# EasyEDA Pro project gen_lora_i2c-revision-2--design.epro

# Schematic Schematic1

## Sheets
1 devices: Board Name: Board1; Create Date: 2026-06-19; Page Name: devices; Project Name: esp32c3_carrier-revision-1; Schematic Name: Schematic1; Update Date: 2026-06-19; Company: EasyEDA.com; Page Size: A4; Version: V1.0
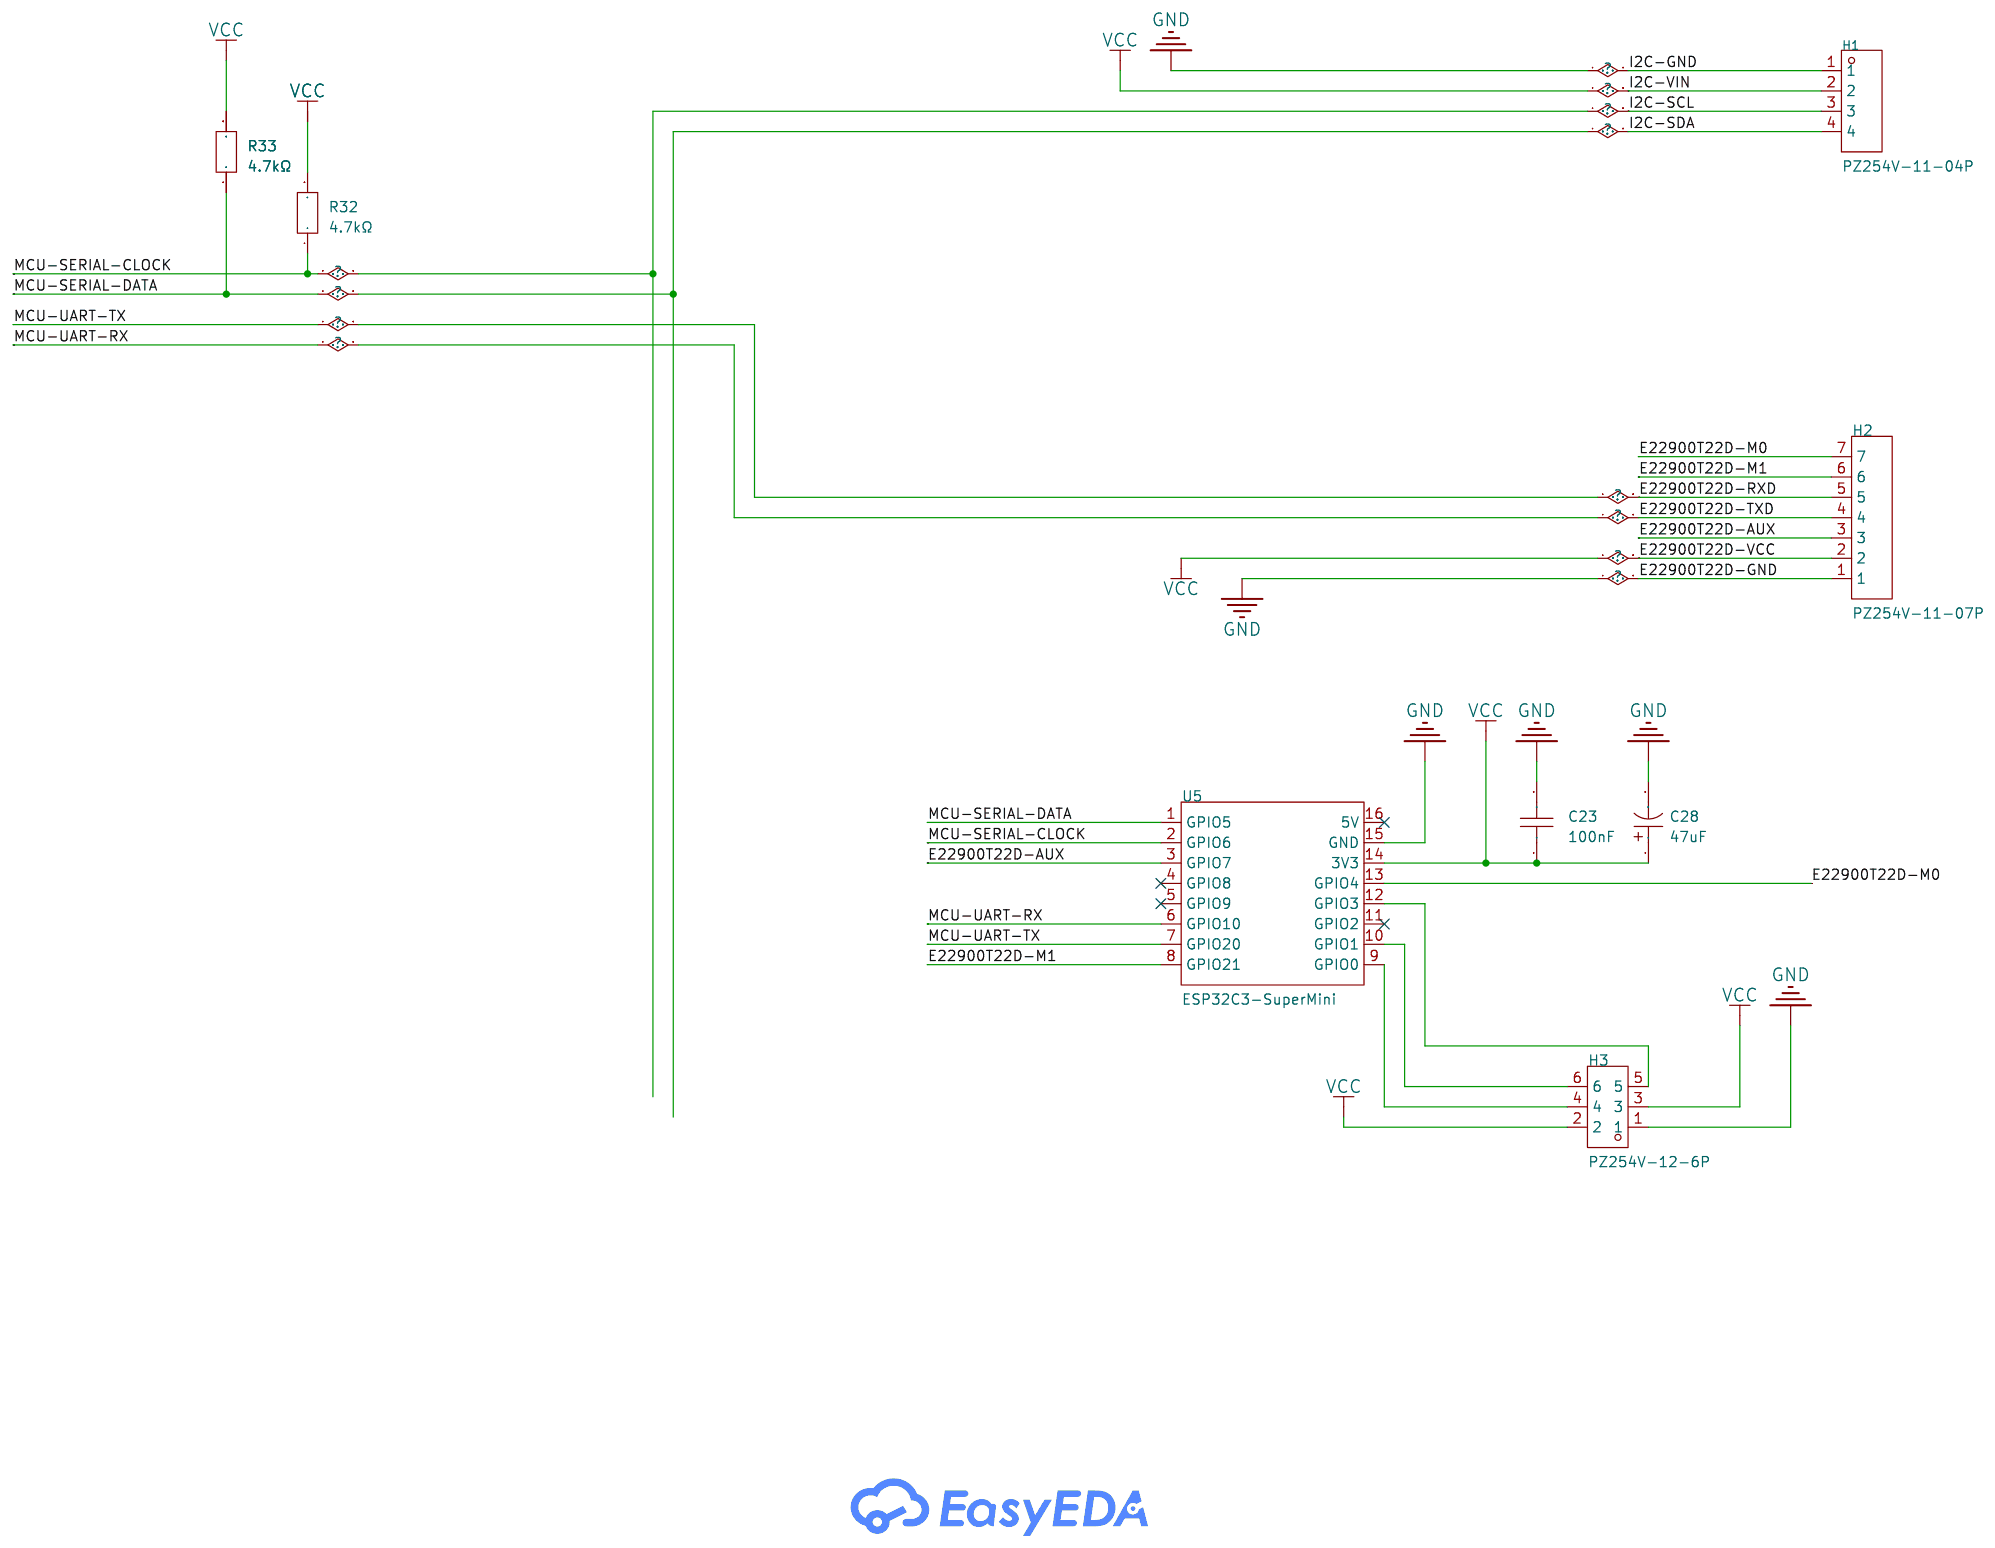
[diagram p0: devices]
2 pinouts: Create Date: 2026-06-17; Page Name: pinouts; Project Name: esp32c3_carrier; Update Date: 2026-06-17
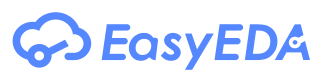
[diagram p1: pinouts]

## Parts
C23  100nF  [CAP-TH_L5.0-W2.5-P5.00-D1.0]
C28  47uF  [CAP-TH_BD5.0-P2.00-D0.5-FD-1]
H1  PZ254V-11-04P  [HDR-TH_4P-P2.54-V-M]
H2  PZ254V-11-07P  [HDR-TH_7P-P2.54-V-M]
H3  PZ254V-12-6P  [HDR-TH_6P-P2.54-V-M-R2-C3-S2.54]
R32  4.7kΩ  [RES-TH_BD2.4-L6.3-P10.30-D0.6]
R33  4.7kΩ  [RES-TH_BD2.4-L6.3-P10.30-D0.6]
U5  ESP32C3-SuperMini  [COMM-SMD_16P-L22.5-W18.0-P2.54-TL]

## Library data of the parts
C23 = CC1H104MC1FD3F6C10MF: Capacitance:100nF Tolerance:±20% Tolerance:±20% Voltage Rating:50V Pin Spacing:5.08mm Temperature Coefficient:Y5V Diameter:6mm Body Thickness:2.2mm; LCSC Part Name: 100nF ±20% 50V; Supplier Part: C254085; Manufacturer: Dersonic(德尔创); Supplier Footprint: 插件,P=5.08mm; JLCPCB Part Class: Extended Part; Datasheet: https://item.szlcsc.com/datasheet/CC1H104MC1FD3F6C10MF/248635.html; Supplier: LCSC; Tolerance: ±20%; Voltage Rating: 50V; Pin Spacing: 5.08mm; Temperature Coefficient: Y5V; Diameter: 6mm; Body Thickness: 2.2mm
C28 = 50V10uF CD110_C2960373: Capacitance:10uF Tolerance:±20% Tolerance:±20% Voltage Rating:50V Pin Spacing:2mm Diameter:5mm Height - Seated (Max):11mm Operating Temperature:-40℃~+105℃ Operating Temperature:-40℃~+105℃; LCSC Part Name: 10uF ±20% 50V; Supplier Part: C2960373; Manufacturer: HRK(鸿瑞凯电子); Manufacturer Part: 50V10uF CD110; Supplier Footprint: 插件,D5xL11mm; JLCPCB Part Class: Extended Part; Datasheet: https://item.szlcsc.com/datasheet/50V10uF%2520CD110/3347175.html; Supplier: LCSC; Tolerance: ±20%; Voltage Rating: 50V; Pin Spacing: 2mm; Diameter: 5mm; Height - Seated (Max): 11mm; Operating Temperature: -40℃~+105℃
H1 = PZ254V-11-04P: Pin Structure:1x4P Pitch:2.54mm Row Spacing:- Circluar Pins/Square Pins:Pin Header Mounting Type:Through Hole Number of Rows:1 Number of Pins:4P Current Rating:3A Voltage Rating (Max):250V Length of Mating Pin:6mm Insulation Height:2.5mm Length of End Con; LCSC Part Name: 1x4P 间距:2.54mm 方针 直插; Supplier Part: C2691448; Manufacturer: XFCN(兴飞); Supplier Footprint: 插件,P=2.54mm; JLCPCB Part Class: Extended Part; Datasheet: https://item.szlcsc.com/datasheet/PZ254V-11-04P/2801085.html; Supplier: LCSC; Pin Structure: 1x4P; Pitch: 2.54mm; Circluar Pins/Square Pins: Pin Header; Mounting Type: Through Hole; Number of Rows: 1; Number of Pins: 4P; Current Rating: 3A; Voltage Rating (Max): 250V; Length of Mating Pin: 6mm; Insulation Height: 2.5mm; Length of End Connection Pin: 3mm; Operating Temperature: -40℃~+105℃; Color: Black
H2 = PZ254V-11-07P: Pin Structure:1x7P Pitch:2.54mm Row Spacing:- Circluar Pins/Square Pins:Pin Header Mounting Type:Through Hole Number of Rows:1 Number of Pins:7P Current Rating:3A Voltage Rating (Max):250V Length of Mating Pin:6mm Insulation Height:2.5mm Length of End Con; LCSC Part Name: 1x7P 间距:2.54mm 方针 直插; Supplier Part: C492406; Manufacturer: XFCN(兴飞); Supplier Footprint: 插件,P=2.54mm; JLCPCB Part Class: Extended Part; Datasheet: https://item.szlcsc.com/datasheet/PZ254V-11-07P/502962.html; Supplier: LCSC; Pin Structure: 1x7P; Pitch: 2.54mm; Circluar Pins/Square Pins: Pin Header; Mounting Type: Through Hole; Number of Rows: 1; Number of Pins: 7P; Current Rating: 3A; Voltage Rating (Max): 250V; Length of Mating Pin: 6mm; Insulation Height: 2.5mm; Length of End Connection Pin: 3mm; Contact Material: Brass; Operating Temperature: -40℃~+105℃; Color: Black
H3 = PZ254V-12-6P: Pin Structure:2x3P Pitch:2.54mm Row Spacing:2.54mm Circluar Pins/Square Pins:Square Pins Mounting Type:Straight Number of Rows:双排 Number of Pins:6P Current Rating (Max):- Voltage Rating (Max):- Length of Mating Pin:6mm Insulation Height:2.5mm Length of En; LCSC Part Name: 间距:2.54mm 2x3P 直插 方针; Supplier Part: C492420; Manufacturer: XFCN(兴飞); Supplier Footprint: 插件,P=2.54mm; JLCPCB Part Class: Extended Part; Datasheet: https://atta.szlcsc.com/upload/public/pdf/source/20200309/C492420_BAECB307B001054C09D200388220EAE6.pdf; Supplier: LCSC; Pin Structure: 2x3P; Pitch: 2.54mm; Row Spacing: 2.54mm; Circluar Pins/Square Pins: Square Pins; Mounting Type: Straight; Number of Rows: 双排; Number of Pins: 6P; Length of Mating Pin: 6mm; Insulation Height: 2.5mm; Length of End Connection Pin: 3mm; Operating Temperature Range: -40℃~+105℃; Color: Black
R32 R33 = RN1/4W10KFT/BA1: Type:Metal Film Resistors Resistance:10kΩ Tolerance:±1% Tolerance:±1% Voltage-Supply(Max):250V Power(Watts):250mW Temperature Coefficient:±50ppm/℃ Temperature Coefficient:±50ppm/℃ Operating Temperature:-55℃~+125℃ Operating Temperature:-55℃~+125℃; LCSC Part Name: 10kΩ ±1% 250mW 金属膜电阻; Supplier Part: C410695; Manufacturer: Tyohm(幸亚电阻); Supplier Footprint: 插件,D2.4xL6.5mm; JLCPCB Part Class: Extended Part; Datasheet: https://atta.szlcsc.com/upload/public/pdf/source/20250211/2C0505E212032D72CE625B2E6B5197BA.pdf; Supplier: LCSC; Type: Metal Film Resistors; Tolerance: ±1%; Voltage-Supply(Max): 250V; Power(Watts): 250mW; Temperature Coefficient: ±50ppm/℃; Operating Temperature: -55℃~+125℃
U5 = ESP32C3-SuperMini: Supplier Part: C9900147397; Supplier Footprint: SMD-16P; JLCPCB Part Class: Extended Part; Supplier: LCSC

## Nets
GND: C23.2 C28.2 H1.1 H2.1 H3.1 U5.15(GND)
VCC: C23.1 C28.1 H1.2 H2.2 H3.2 H3.3 R32.2 R33.2 U5.14(3V3)
E22900T22D-AUX: H2.3 U5.3(GPIO7)
E22900T22D-M0: H2.7 U5.13(GPIO4)
E22900T22D-M1: H2.6 U5.8(GPIO21)
E22900T22D-RXD: H2.5 U5.7(GPIO20)
E22900T22D-TXD: H2.4 U5.6(GPIO10)
I2C-SCL: H1.3 R32.1 U5.2(GPIO6)
I2C-SDA: H1.4 R33.1 U5.1(GPIO5)
$3N17273: H3.4 U5.9(GPIO0)
$3N17278: H3.6 U5.10(GPIO1)
$3N17333: H3.5 U5.12(GPIO3)

Not connected (* = marked no-connect by the designer): U5 4(GPIO8)* 5(GPIO9)* 11(GPIO2)* 16(5V)*

# Board PCB1
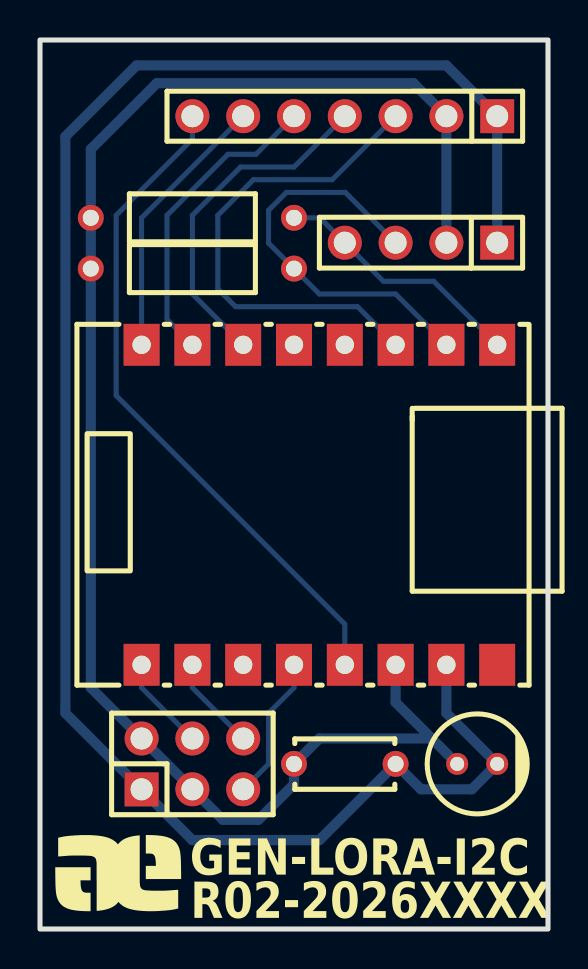
[diagram p2: board, top side]
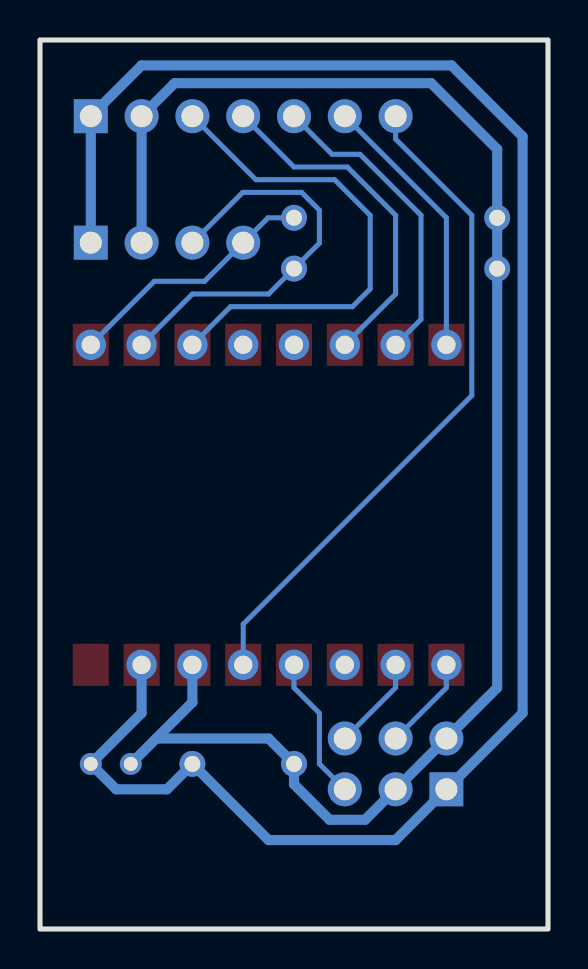
[diagram p3: board, bottom side, seen from below]

Outline 25.4 x 44.45 mm; copper layers: Top Layer, Bottom Layer. Coordinates in mm from the lower left corner of the outline.
Outline path: rectangle 0,44.45 25.4,0
Stack: Top Layer 0.035mm / Dielectric1 1.51mm FR4 er 4.5 / Bottom Layer 0.035mm

## Design rules (mm)
template: JLCPCB Capability(Two Layers Board)
spacing copperThickness1oz (default): track to track 0.102, other pairs 0.152 to 0.3
spacing copperThickness2oz: track to track 0.203, other pairs 0.152 to 0.3
track width copperThickness1oz (default): min 0.127, default 0.254, max 2.54
track width copperThickness2oz: min 0.203, default 0.254, max 2.54
differential pair differentialPair (default): width min 0.127, default 0.254, max 2.54; gap min 0.152, default 0.152
via viaSize (default): diameter min 0.5, default 0.61, max 10; hole min 0.3, default 0.305, max 6.3

## Placement (name value [footprint] x y rotation side)
C23  100nF  [CAP-TH_L5.0-W2.5-P5.00-D1.0]  15.24 8.26 0 top
C28  47uF  [CAP-TH_BD5.0-P2.00-D0.5-FD-1]  21.86 8.26 0 top
H1  PZ254V-11-04P  [HDR-TH_4P-P2.54-V-M]  19.05 34.32 180 top
H2  PZ254V-11-07P  [HDR-TH_7P-P2.54-V-M]  15.24 40.64 180 top
H3  PZ254V-12-6P  [HDR-TH_6P-P2.54-V-M-R2-C3-S2.54]  7.62 8.26 0 top
NOREF  -  [Pad_e2541]  10.16 13.21 270 top
NOREF#2  -  [Pad_e2369]  17.78 13.21 270 top
NOREF#3  -  [Pad_e2368]  20.32 13.21 270 top
NOREF#4  -  [Pad_e2547]  12.7 29.21 270 top
NOREF#5  -  [Pad_e2545]  5.08 29.21 270 top
NOREF#6  -  [Pad_e2540]  12.7 13.21 270 top
NOREF#7  -  [Pad_e2365]  20.32 29.21 270 top
NOREF#8  -  [Pad_e2543]  5.08 13.21 270 top
NOREF#9  -  [Pad_e2546]  7.62 29.21 270 top
NOREF#10  -  [Pad_e2542]  7.62 13.21 270 top
NOREF#11  -  [Pad_e2549]  10.16 29.21 270 top
NOREF#12  -  [Pad_e2366]  17.78 29.21 270 top
NOREF#13  -  [Pad_e2548]  15.24 29.21 270 top
NOREF#14  -  [Pad_e2364]  22.86 29.21 270 top
NOREF#15  -  [Pad_e2539]  15.24 13.21 270 top
R32  4.7kΩ  [RES-TH_BD2.4-L6.3-P10.30-D0.6]  7.62 33.02 180 top
R33  4.7kΩ  [RES-TH_BD2.4-L6.3-P10.30-D0.6]  7.62 35.56 180 top
U5  ESP32C3-SuperMini  [COMM-SMD_16P-L22.5-W18.0-P2.54-TL]  13.97 21.21 270 top

## Footprints (pads in the part's own frame, mm; a bottom-side part is the same pattern mirrored in y, then rotated)
CAP-TH_BD5.0-P2.00-D0.5-FD-1
  round 1.1 hole 0.7: 1(-1,0) 2(1,0)
CAP-TH_L5.0-W2.5-P5.00-D1.0
  round 1.3 hole 0.8: 1(-2.54,0) 2(2.54,0)
COMM-SMD_16P-L22.5-W18.0-P2.54-TL
  rect 2.102x1.802 smd: 1(-8.001,8.89) 2(-8.001,6.35) 3(-8.001,3.81) 4(-8.001,1.27) 5(-8.001,-1.27) 6(-8.001,-3.81) 7(-8.001,-6.35) 8(-8.001,-8.89) 9(8.001,-8.89) 10(8.001,-6.35) 11(8.001,-3.81) 12(8.001,-1.27) 13(8.001,1.27) 14(8.001,3.81) 15(8.001,6.35) 16(8.001,8.89)
HDR-TH_4P-P2.54-V-M
  rect 1.7x1.7 hole 1.1: 1(-3.81,0)
  round 1.7 hole 1.1: 2(-1.27,0) 3(1.27,0) 4(3.81,0)
HDR-TH_6P-P2.54-V-M-R2-C3-S2.54
  rect 1.7x1.7 hole 1.1: 1(-2.54,-1.27)
  round 1.7 hole 1.1: 2(-2.54,1.27) 3(0,-1.27) 4(0,1.27) 5(2.54,-1.27) 6(2.54,1.27)
HDR-TH_7P-P2.54-V-M
  rect 1.7x1.7 hole 1.1: 1(-7.62,0)
  round 1.7 hole 1.1: 2(-5.08,0) 3(-2.54,0) 4(0,0) 5(2.54,0) 6(5.08,0) 7(7.62,0)
Pad_e2364
  round 1.524 hole 0.914: 1(0,0)
Pad_e2365
  round 1.524 hole 0.914: 2(0,0)
Pad_e2366
  round 1.524 hole 0.914: 3(0,0)
Pad_e2368
  round 1.524 hole 0.914: 1(0,0)
Pad_e2369
  round 1.524 hole 0.914: 2(0,0)
Pad_e2539
  round 1.524 hole 0.914: 1(0,0)
Pad_e2540
  round 1.524 hole 0.914: 2(0,0)
Pad_e2541
  round 1.524 hole 0.914: 3(0,0)
Pad_e2542
  round 1.524 hole 0.914: 4(0,0)
Pad_e2543
  round 1.524 hole 0.914: 5(0,0)
Pad_e2545
  round 1.524 hole 0.914: 1(0,0)
Pad_e2546
  round 1.524 hole 0.914: 2(0,0)
Pad_e2547
  round 1.524 hole 0.914: 3(0,0)
Pad_e2548
  round 1.524 hole 0.914: 4(0,0)
Pad_e2549
  round 1.524 hole 0.914: 5(0,0)
RES-TH_BD2.4-L6.3-P10.30-D0.6
  round 1.3 hole 0.8: 1(-5.08,0) 2(5.08,0)

## Nets
GND: C23.2 C28.2 H1.1 H2.1 H3.1 NOREF#3.1 U5.15
VCC: C23.1 C28.1 H1.2 H2.2 H3.2 H3.3 NOREF#2.2 R32.2 R33.2 U5.14
E22900T22D-AUX: H2.3 NOREF#12.3 U5.3
E22900T22D-M0: H2.7 NOREF#15.1 U5.13
E22900T22D-M1: H2.6 NOREF#5.1 U5.8
E22900T22D-RXD: H2.5 NOREF#9.2 U5.7
E22900T22D-TXD: H2.4 NOREF#11.5 U5.6
I2C-SCL: H1.3 NOREF#7.2 R32.1 U5.2
I2C-SDA: H1.4 NOREF#14.1 R33.1 U5.1
$3N17273: H3.4 NOREF#8.5 U5.9
$3N17278: H3.6 NOREF#10.4 U5.10
$3N17333: H3.5 NOREF#6.2 U5.12

Pads without a net: NOREF 3; NOREF#4 3; NOREF#13 4; U5 4 5 11 16

## Routing (per net, layer and track width the routed paths; a pad name or vN(x,y) marks a point on that pad's centre or on a via; arc(x,y) is an arc through that point)
GND: length 92.1
  Bottom Layer w0.508: H1.1 H2.1 20.32,43.18 4.83,43.18 1.27,39.62 1.27,10.8 H3.1 7.62,4.45 13.97,4.45 C23.2 19.05,6.98 21.59,6.98 C28.2 20.32,10.8 U5.15
VCC: length 81.4
  Bottom Layer w0.508: H1.2 H2.2 18.67,42.29 5.84,42.29 2.54,38.99 R33.2 R32.2 2.54,12.06 H3.2 H3.3 9.14,5.46 10.92,5.46 12.7,7.24 C23.1 13.97,9.53 19.59,9.53 ; 19.59,9.53 17.78,11.34 U5.14 ; 19.59,9.53 C28.1
E22900T22D-AUX: length 24.7
  Bottom Layer w0.254: U5.3 15.88,31.12 9.78,31.12 8.89,32 8.89,35.69 10.67,37.47 14.6,37.47 H2.3
E22900T22D-M0: length 33.7
  Bottom Layer w0.254: H2.7 7.62,39.5 3.81,35.69 3.81,26.67 15.24,15.24 U5.13
E22900T22D-M1: length 13.5
  Bottom Layer w0.254: U5.8 5.08,35.56 H2.6
E22900T22D-RXD: length 15.4
  Bottom Layer w0.254: U5.7 6.35,30.48 6.35,35.69 9.4,38.73 10.79,38.73 H2.5
E22900T22D-TXD: length 17.2
  Bottom Layer w0.254: U5.6 7.62,31.75 7.62,35.69 10.03,38.1 12.7,38.1 H2.4
I2C-SCL: length 20.4
  Bottom Layer w0.254: H1.3 15.27,36.83 12.32,36.83 11.43,35.94 11.43,34.29 R32.1 13.97,31.75 17.78,31.75 U5.2
I2C-SDA: length 12.8
  Bottom Layer w0.254: R33.1 14,35.56 H1.4 17.17,32.39 19.69,32.39 U5.1
$3N17273: length 4.7
  Bottom Layer w0.254: H3.4 5.08,12.06 U5.9
$3N17278: length 4.7
  Bottom Layer w0.254: U5.10 7.62,12.06 H3.6
$3N17333: length 7.3
  Bottom Layer w0.254: H3.5 11.43,8.26 11.43,10.8 12.7,12.06 U5.12

## Text on the board
Top Silkscreen Layer: GEN-LORA-I2C | R02-2026XXXX
